# Altium schematic sheet 04_POWER.SchDoc
size A4; Author: Sasa Karanovic; Organization: Altium Limited; DocumentNumber: 1; SheetNumber: 4; SheetTotal: 4; sk_ProjectName: DIY E-Ink Gadget; sk_title: Power and Battery Charging
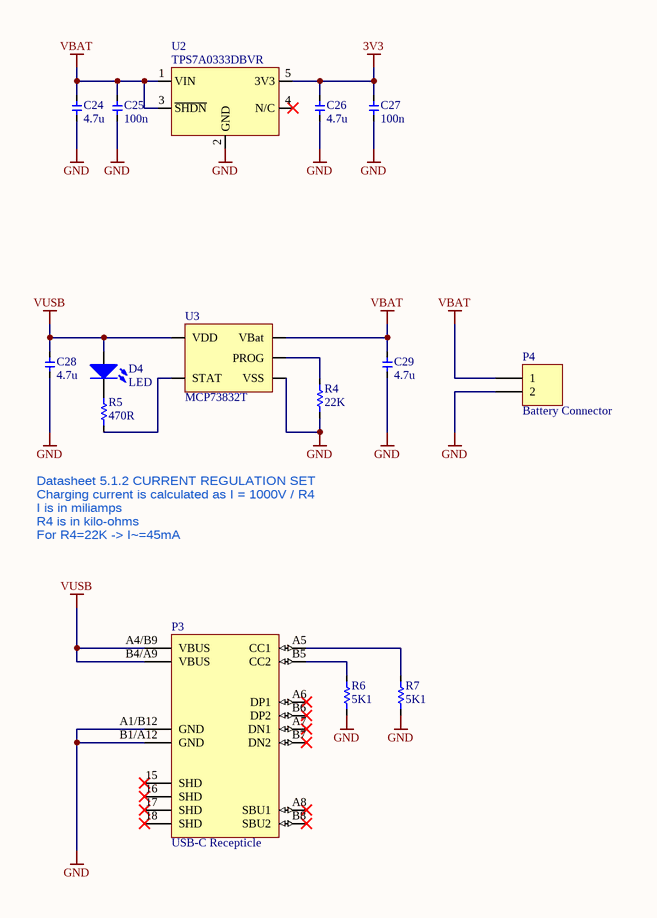
[diagram p0: 04_POWER.SchDoc]

## Parts
C24  value 4.7u  [0603 - CAP HS]  (hidden comment: Cap)
C25  value 100n  [0603 - CAP HS]  (hidden comment: Cap)
C26  value 4.7u  [0603 - CAP HS]  (hidden comment: Cap)
C27  value 100n  [0603 - CAP HS]  (hidden comment: Cap)
C28  value 4.7u  [0603 - CAP HS]  (hidden comment: Cap)
C29  value 4.7u  [0603 - CAP HS]  (hidden comment: Cap)
D4  LED  [0603 Diode]
P3  USB-C Recepticle  [GCT_USB4105-GF-A]
P4  Battery Connector  [Header 2x1 SMD]  (no BOM)
R4  value 22K  [0603]  (hidden comment: Res)
R5  value 470R  [0603]  (hidden comment: Res)
R6  value 5K1  [0603]  (hidden comment: Res)
R7  value 5K1  [0603]  (hidden comment: Res)
U2  TPS7A0333DBVR  [SOT-23-5]
U3  MCP73832T  [SOT-23-5]

## Nets
3V3: C26.1 C27.1 U2.5(3V3)
GND: C24.2 C25.2 C26.2 C27.2 C28.2 C29.2 P3.A1/B12(GND) P3.B1/A12(GND) P4.2 R4.1 R6.1 R7.1 U2.2(GND) U3.2(VSS)
VBAT: C24.1 C25.1 C29.1 P4.1 U2.1(VIN) U2.3(~{SHDN}) U3.3(VBat)
VUSB: C28.1 D4.A P3.A4/B9(VBUS) P3.B4/A9(VBUS) U3.4(VDD)
NetD4_K: D4.K R5.2
NetP3_A5: P3.A5(CC1) R7.2
NetP3_B5: P3.B5(CC2) R6.2
NetR4_2: R4.2 U3.5(PROG)
NetR5_1: R5.1 U3.1(STAT)

Not connected (* = marked no-connect by the designer): P3 15(SHD)* 16(SHD)* 17(SHD)* 18(SHD)* A6(DP1)* A7(DN1)* A8(SBU1)* B6(DP2)* B7(DN2)* B8(SBU2)*; U2 4(N/C)*

## Notes on the sheet
- Datasheet 5.1.2 CURRENT REGULATION SET
  Charging current is calculated as I = 1000V / R4
  I is in miliamps
  R4 is in kilo-ohms
  For R4=22K -> I~=45mA
- Page
- Title
- www.SasaKaranovic.com <http://www.SasaKaranovic.com>
- of

## Library data of the parts
C24 C26 C28 C29 = Cap: Capacitor; Manufacturer: Samsung Electro-Mechanics; Manufacturer Part Number: CL10B475KQ8NQNC; Distributor Part Number: 1276-2087-1-ND; Distributor: DigiKey
C25 C27 = Cap: Capacitor; Manufacturer: Samsung Electro-Mechanics; Manufacturer Part Number: CL10B104KB8NNWC; Distributor Part Number: 1276-1935-1-ND; Distributor: DigiKey
D4 = LED: Typical RED GaAs LED; Manufacturer: Lite-On Inc.; Manufacturer Part Number: LTST-C193KRKT-5A; Distributor: DigiKey; Distributor Part Number: Lite-On Inc.
P3 = USB-C Recepticle: CONN RCPT USB2.0 TYPEC 5A; Manufacturer: GCT; Manufacturer Part Number: USB4105-GF-A; Distributor Part Number: 2073-USB4105-GF-ACT-ND; Distributor: DigiKey
P4 = Header 2: Header, 2-Pin
R4 = Res: Resistor; Manufacturer: YAGEO; Manufacturer Part Number: AC0603FR-1022KL; Distributor: DigiKey; Distributor Part Number: 13-AC0603FR-1022KLCT-ND
R5 = Res: Resistor; Manufacturer: YAGEO; Manufacturer Part Number: RC0603FR-10470RL; Distributor: DigiKey; Distributor Part Number: 13-RC0603FR-10470RLCT-ND
R6 R7 = Res: Resistor; Manufacturer: YAGEO; Manufacturer Part Number: RC0603FR-135K1L; Distributor: DigiKey; Distributor Part Number: 13-RC0603FR-135K1LCT-ND
U2 = NCP161ASN330T1G: Linear Voltage Regulator IC  1 Output  450mA SOT-23-5; Manufacturer: ON Semiconductor; Distributor: DigiKey; Distributor Part Number: NCP161ASN330T1GOSCT-ND; Manufacturer Part Number: NCP161ASN330T1G
U3 = MCP73832: 1xLi-Ion char, 0.5A, 4.2V reg, 3.75-6V; Manufacturer: Microchip Technology; Manufacturer Part Number: MCP73832T-2ACI/OT; Distributor: DigiKey; Distributor Part Number: MCP73832T-2ACI/OTCT-ND